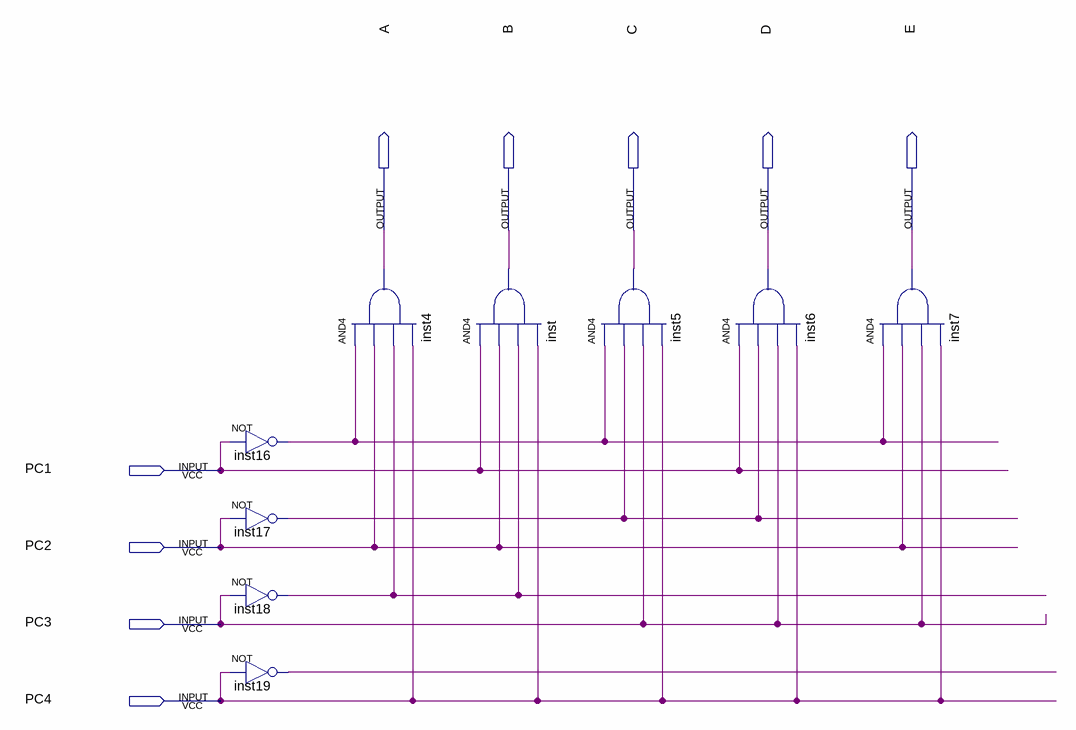
[diagram p0: schematic sheet]
// Quartus schematic PBL1.bdf as structural Verilog: 9 symbols, 9 pins
module PBL1 (
  input  PC1,
  input  PC2,
  input  PC3,
  input  PC4,
  output A,
  output B,
  output C,
  output D,
  output E
);

  wire inst16_out, inst17_out, inst18_out, inst19_out;

  not inst16 (inst16_out, PC1);
  not inst17 (inst17_out, PC2);
  not inst18 (inst18_out, PC3);
  not inst19 (inst19_out, PC4);
  and inst4 (A, inst16_out, PC2, inst18_out, PC4);
  and inst (B, PC1, PC2, inst18_out, PC4);
  and inst5 (C, inst16_out, inst17_out, PC3, PC4);
  and inst6 (D, PC1, inst17_out, PC3, PC4);
  and inst7 (E, inst16_out, PC2, PC3, PC4);
endmodule
